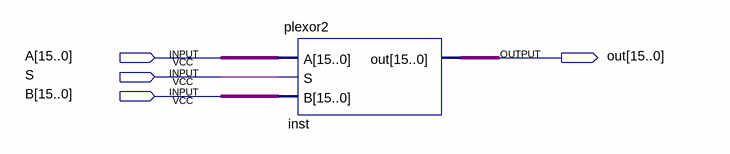
[diagram p0: schematic sheet]
// Quartus schematic test.bdf as structural Verilog: 1 symbols, 4 pins
module test (
  input  [15:0] A,
  input  S,
  input  [15:0] B,
  output [15:0] out
);

  plexor2 inst (.A(A), .S(S), .B(B), .out(out));
endmodule
